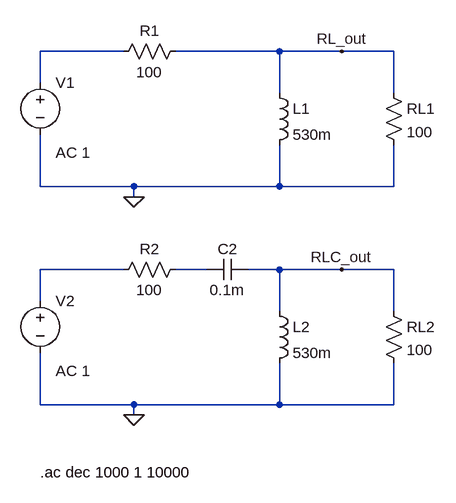
[diagram p0: schematic 03 RL- RLC-Filter Belastung.asc]
03 RL- RLC-Filter Belastung.asc, the LTspice schematic file:
Version 4
SHEET 1 880 680
WIRE 32 -208 -96 -208
WIRE 272 -208 112 -208
WIRE 368 -208 272 -208
WIRE 448 -208 368 -208
WIRE -96 -160 -96 -208
WIRE 272 -144 272 -208
WIRE 448 -144 448 -208
WIRE -96 0 -96 -80
WIRE 48 0 -96 0
WIRE 272 0 272 -64
WIRE 272 0 48 0
WIRE 448 0 448 -64
WIRE 448 0 272 0
WIRE 48 16 48 0
WIRE 32 128 -96 128
WIRE 160 128 112 128
WIRE 272 128 224 128
WIRE 368 128 272 128
WIRE 448 128 368 128
WIRE -96 176 -96 128
WIRE 272 192 272 128
WIRE 448 192 448 128
WIRE -96 336 -96 256
WIRE 48 336 -96 336
WIRE 272 336 272 272
WIRE 272 336 48 336
WIRE 448 336 448 272
WIRE 448 336 272 336
WIRE 48 352 48 336
FLAG 48 352 0
FLAG 48 16 0
FLAG 368 -208 RL_out
FLAG 368 128 RLC_out
SYMBOL res 128 112 R90
WINDOW 0 0 56 VBottom 2
WINDOW 3 32 56 VTop 2
SYMATTR InstName R2
SYMATTR Value 100
SYMBOL ind 256 176 R0
SYMATTR InstName L2
SYMATTR Value 530m
SYMBOL voltage -96 160 R0
WINDOW 123 24 124 Left 2
WINDOW 39 0 0 Left 0
SYMATTR Value2 AC 1
SYMATTR InstName V2
SYMATTR Value ""
SYMBOL cap 224 112 R90
WINDOW 0 0 32 VBottom 2
WINDOW 3 32 32 VTop 2
SYMATTR InstName C2
SYMATTR Value 0.1m
SYMBOL res 128 -224 R90
WINDOW 0 0 56 VBottom 2
WINDOW 3 32 56 VTop 2
SYMATTR InstName R1
SYMATTR Value 100
SYMBOL ind 256 -160 R0
SYMATTR InstName L1
SYMATTR Value 530m
SYMBOL voltage -96 -176 R0
WINDOW 123 24 124 Left 2
WINDOW 39 0 0 Left 0
SYMATTR Value2 AC 1
SYMATTR InstName V1
SYMATTR Value ""
SYMBOL res 432 -160 R0
SYMATTR InstName RL1
SYMATTR Value 100
SYMBOL res 432 176 R0
SYMATTR InstName RL2
SYMATTR Value 100
TEXT -96 440 Left 2 !.ac dec 1000 1 10000

The netlist it stands for:
* 03 RL- RLC-Filter Belastung.asc
R2 N003 N002 100
L2 RLC_out 0 530m
V2 N002 0 AC 1
C2 RLC_out N003 0.1m
R1 RL_out N001 100
L1 RL_out 0 530m
V1 N001 0 AC 1
RL1 RL_out 0 100
RL2 RLC_out 0 100
.ac dec 1000 1 10000
.backanno
.end